# EasyEDA Pro project mini2.epro

# Schematic Schematic1_2
Create Date: 2023-07-10; Page Name: P1; Project Name: 门禁控制器; Schematic Name: Schematic1_2; Update Date: 2023-10-23; Company: WITGINE TECH; Drawed: 囧大大王; Page Size: A4; Version: V1.0
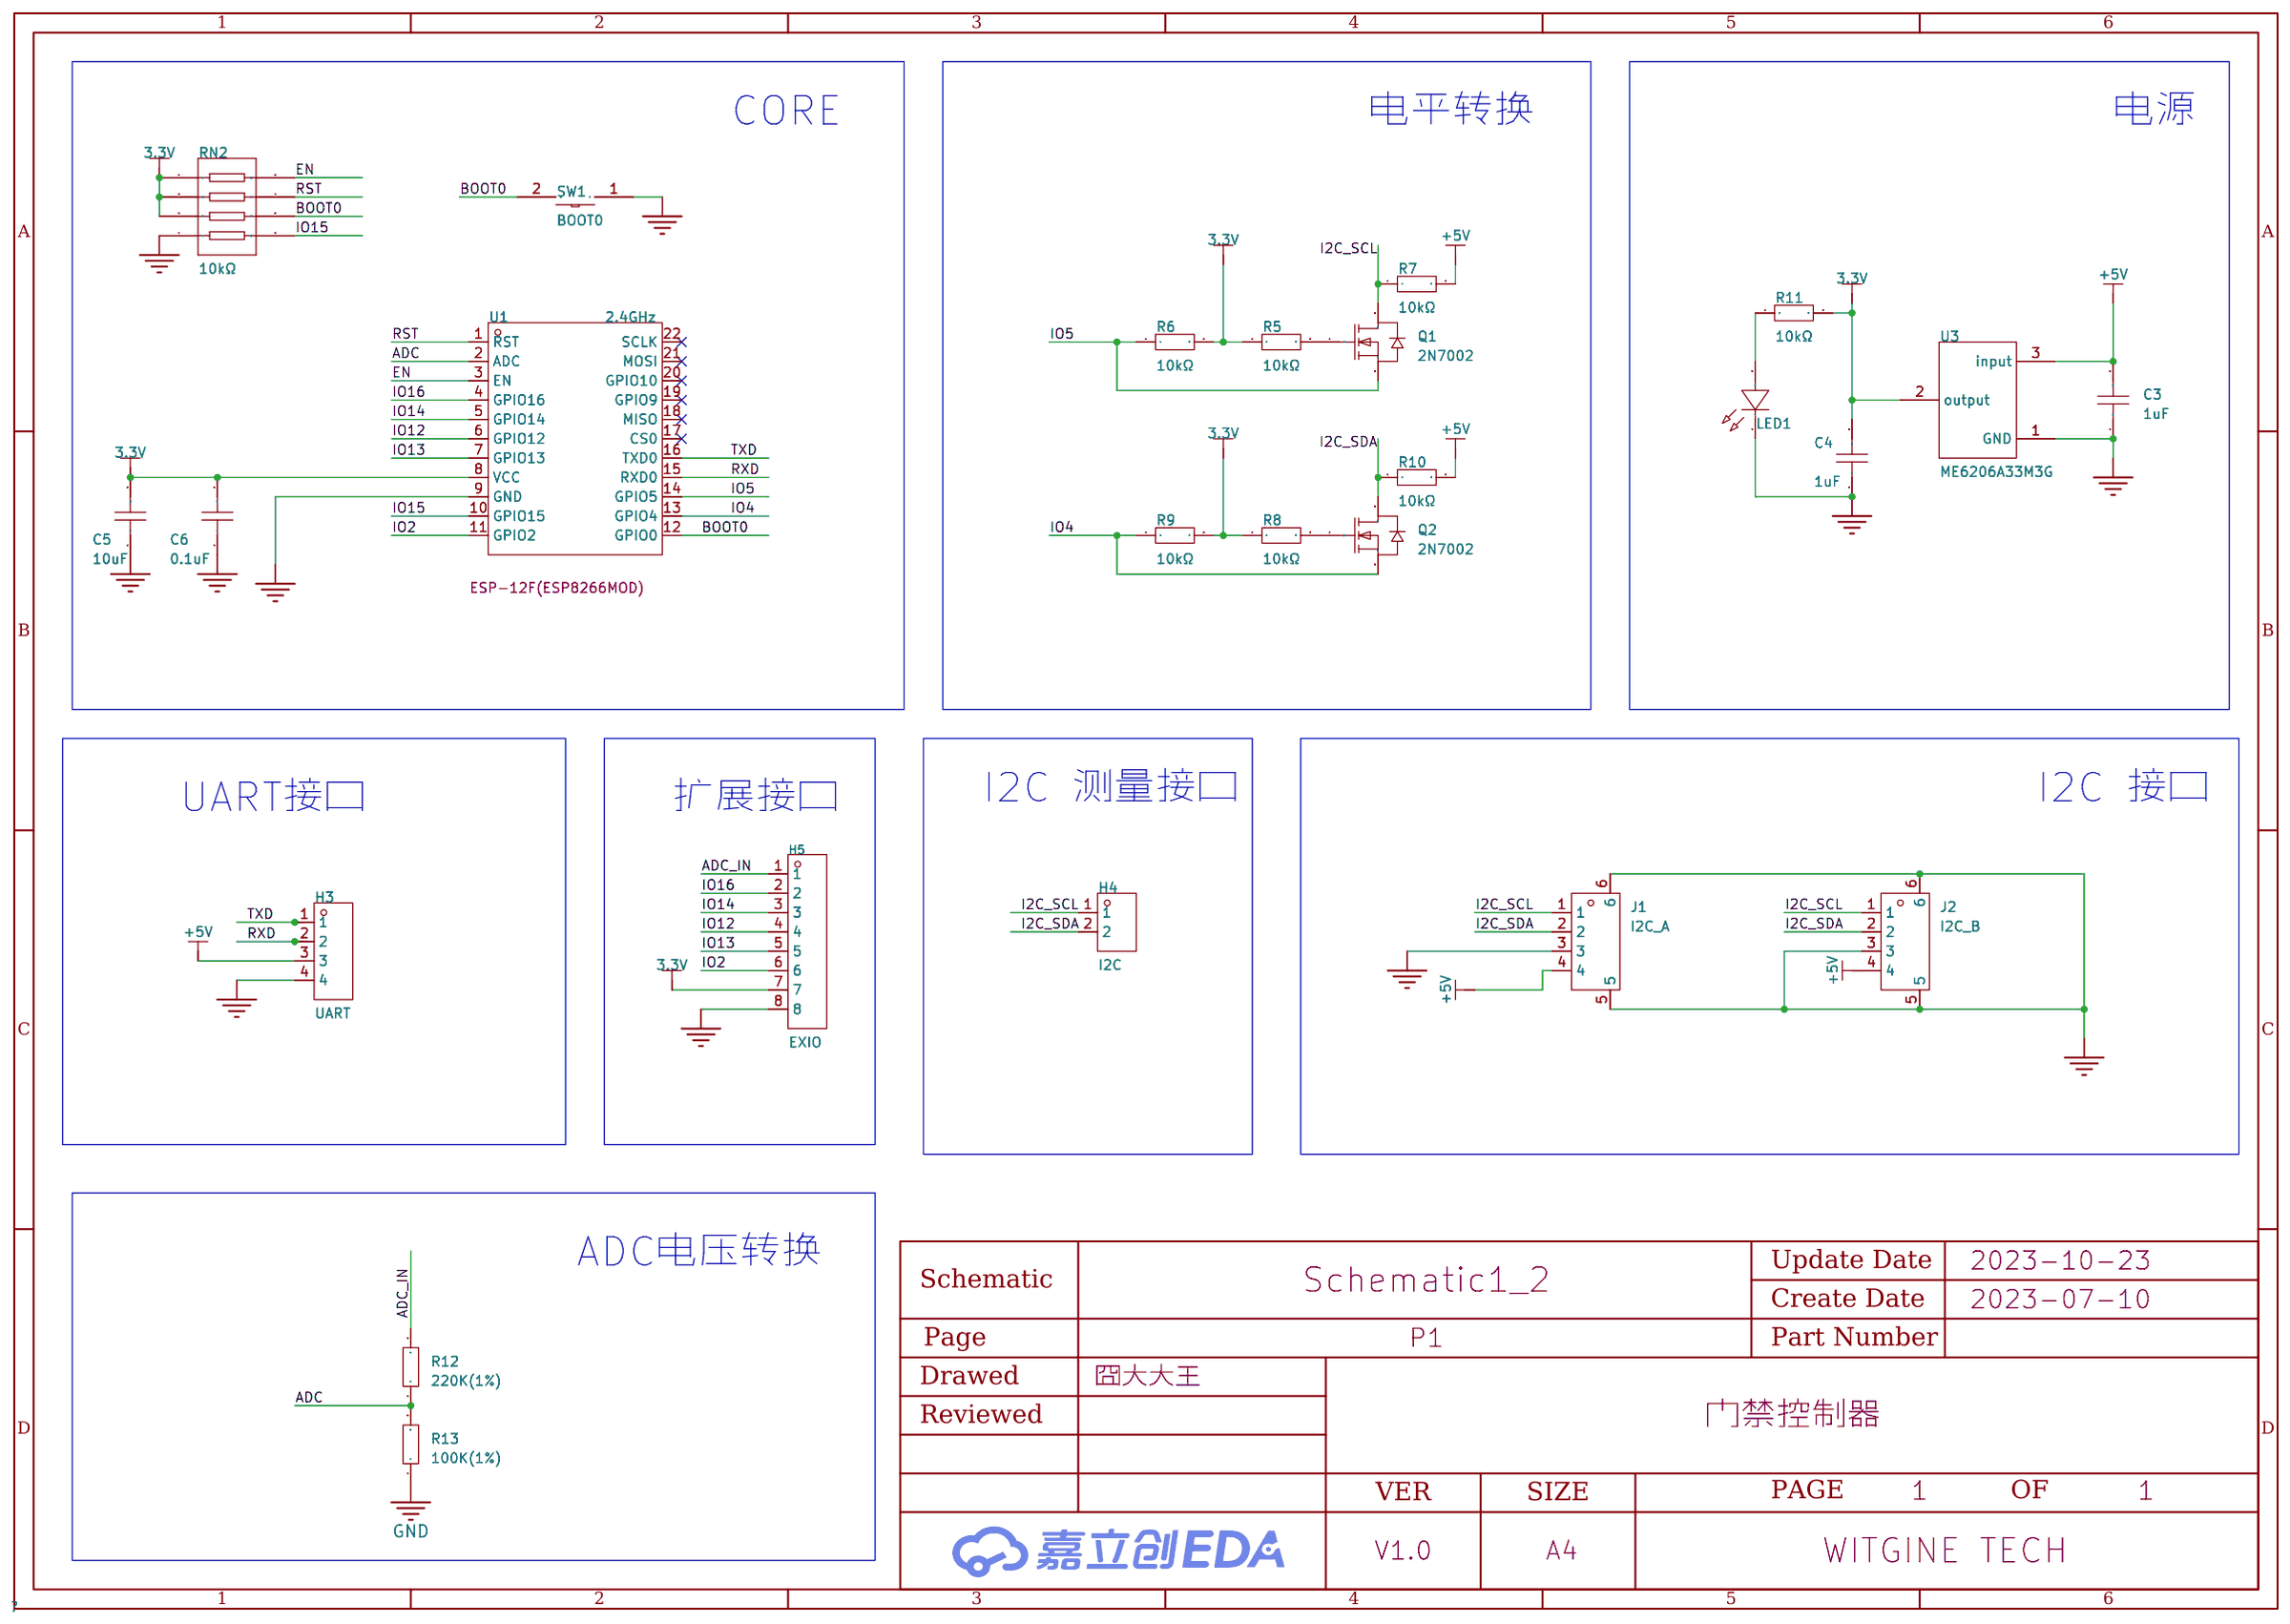
[diagram p0: schematic sheet]

## Parts
C3  1uF  [C0603]
C4  1uF  [C0603]
C5  10uF  [C0603]
C6  0.1uF  [C0603]
H3  UART  [HDR-TH_4P-P2.54-V-M]
H4  I2C  [HDR-TH_2P-P2.54-V-M]
H5  EXIO  [HDR-TH_8P-P2.54-V-M]
J1  I2C_A  [CONN-SMD_1.25-4PWB]
J2  I2C_B  [CONN-SMD_1.25-4PWB]
LED1  XL-1608SURC-06  [LED0603-RD_RED]
Q1  2N7002  [SOT-23-3_L2.9-W1.3-P1.90-LS2.4-BR]
Q2  2N7002  [SOT-23-3_L2.9-W1.3-P1.90-LS2.4-BR]
R5  10kΩ  [R0603]
R6  10kΩ  [R0603]
R7  10kΩ  [R0603]
R8  10kΩ  [R0603]
R9  10kΩ  [R0603]
R10  10kΩ  [R0603]
R11  10kΩ  [R0603]
R12  220K(1%)  [R0603]
R13  100K(1%)  [R0603]
RN2  10kΩ  [RES-ARRAY-SMD_0603-8P-L3.2-W1.6-BL]
SW1  BOOT0  [SW-SMD_L3.9-W3.0-P4.45]
U1  2.4GHz  [WIFIM-SMD_ESP-12F-ESP8266MOD]
U3  ME6206A33M3G  [SOT-23-3_L2.9-W1.6-P1.90-LS2.8-BR]

## Library data of the parts
C3 C5 = CL10A106MA8NRNC: 容值:10uF;精度:±20%;额定电压:25V;材质(温度系数):X5R;; LCSC Part Name: 10uF ±20% 25V; Supplier Part: C96446; Manufacturer: SAMSUNG(三星); Supplier Footprint: 0603; JLCPCB Part Class: Basic Part; Datasheet: https://atta.szlcsc.com/upload/public/pdf/source/20170325/1490427913016.pdf; Supplier: LCSC; Tolerance: ±20%; Voltage Rated: 25V; Temperature Coefficient: X5R
C4 C6 = CL10B104KB8NNNC: 容值:100nF;精度:±10%;额定电压:50V;材质(温度系数):X7R;; LCSC Part Name: 100nF ±10% 50V; Supplier Part: C1591; Manufacturer: SAMSUNG(三星); Supplier Footprint: 0603; JLCPCB Part Class: Extended Part; Datasheet: https://atta.szlcsc.com/upload/public/pdf/source/20160103/1457707680512.pdf; Supplier: LCSC; Tolerance: ±10%; Voltage Rated: 50V; Temperature Coefficient: X7R
H3 = PZ254V-11-04P_C492403: 排数:单排;总PIN位数:4;间距:2.54mm;插针结构:1x4P;行距:-;安装类型:直插;圆针/方针:方针;额定电流:-;额定电压:-;配合针长度:6mm;塑高:2.5mm;端接针长度:3mm;触头材质:黄铜;触头镀层:-;工作温度范围:-40℃~+105℃;颜色:黑色;; LCSC Part Name: 2.54mm 1x4P 直插 方针; Supplier Part: C492403; Manufacturer: XFCN(兴飞); Manufacturer Part: PZ254V-11-04P; Supplier Footprint: 直插,P=2.54mm; JLCPCB Part Class: Extended Part; Datasheet: https://atta.szlcsc.com/upload/public/pdf/source/20200309/C492403_F9F19131791D08044AD4F84F8E751A34.pdf; Supplier: LCSC; Number of Rows: 单排; Number of Pins: 4; Pitch: 2.54mm; Pin Structure: 1x4P; Mounting Type: 直插; Circluar Pins/Square Pins: 方针; Length of Mating Pin: 6mm; Insulation Height: 2.5mm; Length of End Connection Pin: 3mm; Contact Material: 黄铜; Operating Temperature Range: -40℃~+105℃; Color: 黑色
H4 = PZ254V-11-02P: 排数:单排;总PIN位数:2;间距:2.54mm;插针结构:1x2P;行距:-;安装类型:直插;圆针/方针:方针;额定电流:-;额定电压:-;配合针长度:6mm;塑高:2.5mm;端接针长度:3mm;触头材质:黄铜;触头镀层:-;工作温度范围:-40℃~+105℃;颜色:黑色;; LCSC Part Name: 2.54mm 1x2P 直插 方针; Supplier Part: C492401; Manufacturer: XFCN(兴飞); Manufacturer Part: 2.54-1x2P直针; Supplier Footprint: 直插,P=2.54mm; JLCPCB Part Class: Extended Part; Datasheet: https://atta.szlcsc.com/upload/public/pdf/source/20200309/C492401_A812433581A9B211A7FFA413ADDFF0E5.pdf; Supplier: LCSC; Number of Rows: 单排; Number of Pins: 2; Pitch: 2.54mm; Pin Structure: 1x2P; Mounting Type: 直插; Circluar Pins/Square Pins: 方针; Length of Mating Pin: 6mm; Insulation Height: 2.5mm; Length of End Connection Pin: 3mm; Contact Material: 黄铜; Operating Temperature Range: -40℃~+105℃; Color: 黑色
H5 = PZ254V-11-08P: 排数:单排;总PIN位数:8P;间距:2.54mm;插针结构:1x8P;行距:-;安装类型:直插;圆针/方针:方针;额定电流:-;额定电压:-;配合针长度:6mm;塑高:2.5mm;端接针长度:3mm;触头材质:黄铜;触头镀层:-;工作温度范围:-40℃~+105℃;颜色:黑色;; LCSC Part Name: 2.54mm 1x8P 直插 方针; Supplier Part: C492407; Manufacturer: XFCN(兴飞); Supplier Footprint: 插件,P=2.54mm; JLCPCB Part Class: Extended Part; Datasheet: https://atta.szlcsc.com/upload/public/pdf/source/20200309/C492407_83A6FB26A2233368EDB9516968EC6149.pdf; Supplier: LCSC; Number of Rows: 单排; Number of Pins: 8P; Pitch: 2.54mm; Pin Structure: 1x8P; Mounting Type: 直插; Circluar Pins/Square Pins: 方针; Length of Mating Pin: 6mm; Insulation Height: 2.5mm; Length of End Connection Pin: 3mm; Contact Material: 黄铜; Operating Temperature Range: -40℃~+105℃; Color: 黑色
J1 J2 = 1.25-4PWB: 参考系列:-;间距:1.25mm;插针结构:1x4P;排数:1;每排PIN数:4;行距:-;公母:公型插针;安装方式:卧贴;额定电流:-;工作温度范围:-40℃~+85℃;; LCSC Part Name: 1.25mm 1x4P 卧贴; Supplier Part: C2905011; Manufacturer: DEALON(德艺隆); Supplier Footprint: SMD,P=1.25mm; JLCPCB Part Class: Extended Part; Datasheet: https://atta.szlcsc.com/upload/public/pdf/source/20211025/32B11FCE5054D08D2841E43E3DE676AA.pdf; Supplier: LCSC; Pitch: 1.25mm; Pins Structure: 1x4P; Number of Rows: 1; Number of PINs Per Row: 4; Gender: 公型插针; Mounting Style: 卧贴; Operating Temperature Range: -40℃~+85℃
LED1 = XL-1608SURC-06: 发光颜色:红灯;主波长:617nm~621nm;色温:-;功率:55mW;安装方式:正贴;; LCSC Part Name: 红灯 正贴; Supplier Part: C965799; Manufacturer: XINGLIGHT(成兴光); Supplier Footprint: 0603; JLCPCB Part Class: Extended Part; Datasheet: https://atta.szlcsc.com/upload/public/pdf/source/20221102/D860AFDD1CDB02C5A8064103A32707E2.pdf; Supplier: LCSC; Emitted Color: 红灯; Lens Color: 无色透明; Dominant Wavelength: 617nm~621nm; Peak Wavelength: 623nm; Forward Current: 25mA; Power Dissipation: 55mW; Viewing Angle: 120°; Mounting Sytle: 正贴; Operating Temperature: -30℃~+85℃
Q1 Q2 = 2N7002_C8545: 类型:N沟道;漏源电压(Vdss):60V;连续漏极电流(Id):115mA;功率(Pd):200mW;导通电阻(RDS(on)@Vgs,Id):7.5Ω@10V,500mA;阈值电压(Vgs(th)@Id):2.5V@250uA;; LCSC Part Name: N沟道 60V 115mA; Supplier Part: C8545; Manufacturer: CJ(江苏长电/长晶); Supplier Footprint: SOT-23; JLCPCB Part Class: Basic Part; Datasheet: https://atta.szlcsc.com/upload/public/pdf/source/20170302/1488422688078.pdf; Supplier: LCSC; Type: N沟道; Drain Source Voltage (Vdss): 60V; Continuous Drain Current (Id): 115mA; Power Dissipation (Pd): 200mW; Drain Source On Resistance (RDS(on)@Vgs,Id): 7.5Ω@10V,500mA; Gate Threshold Voltage (Vgs(th)@Id): 2.5V@250uA
R5-R10 = RS-03K1002FT: 阻值:10kΩ;精度:±1%;功率:100mW;; LCSC Part Name: 10kΩ ±1% 100mW; Supplier Part: C115324; Manufacturer: FH(风华); Supplier Footprint: 0603; JLCPCB Part Class: Extended Part; Datasheet: https://atta.szlcsc.com/upload/public/pdf/source/20170704/1499151311434.pdf; Supplier: LCSC; Tolerance: ±1%; Power(Watts): 100mW; Temperature Coefficient: ±100ppm/℃; Overload Voltage (Max): 50V; Operating Temperature Range: -55℃~+155℃
R11-R13 = Res_0603: Supplier Footprint: 0603
RN2 = 4D03WGJ0103T5E: 阻值:10kΩ;精度:±5%;单个元件功率:62.5mW;电阻器数:4;; LCSC Part Name: 10kΩ ±5%; Supplier Part: C29718; Manufacturer: UNI-ROYAL(厚声); Supplier Footprint: 0603x4; JLCPCB Part Class: Basic Part; Datasheet: https://atta.szlcsc.com/upload/public/pdf/source/20170615/1497511005633.pdf; Supplier: LCSC; Tolerance: ±5%; Power(Watts): 62.5mW; Number of Resistors: 4; Number of Pins: 8; Temperature Coefficient: ±200ppm/℃
SW1 = TS-1088-AR02016: 触点电流:50mA;额定电压(DC):12V;绝缘电阻:100MΩ;电路结构:单刀单掷;安装方式:立贴;作用力:160gf@±50gf;机械寿命:10万次;带支架:否;; LCSC Part Name: 4*3*2mm 立贴 轻触开关; Supplier Part: C720477; Manufacturer: XUNPU(讯普); Supplier Footprint: SMD; JLCPCB Part Class: Extended Part; Datasheet: https://atta.szlcsc.com/upload/public/pdf/source/20200810/C720475_60D09DD6C54279ADDB2DC25100F1CC11.pdf; Supplier: LCSC; Contact Current: 50mA; Voltage Rating (DC): 12V; Insulation Resistance: 100MΩ; Circuit: 单刀单掷; Mounting Style: 立贴; Actuator Style: 圆形按钮; Actuator/Cap Color: 黑色; Operating Force: 160gf@±50gf; Mechanical Life: 10万次; Operating Temperature: -30℃~+80℃; Pin Style: SMD接片; Switch Length: 4mm; Switch Width: 3mm; Switch Height: 2mm; Strike Gundam: 否; With Lamp: 无
U1 = ESP-12F(ESP8266MOD): 频率:2.4GHz;发射功率:16dBm;核心处理器:ESP8266;天线形式:PCB 板载天线;接收灵敏度:-90dBm;; LCSC Part Name: 完整的802.11b/g/n Wi-Fi的SoC模块; Supplier Part: C82891; Manufacturer: Ai-Thinker(安信可); Supplier Footprint: SMD,16x24mm; JLCPCB Part Class: 扩展库; Datasheet: https://atta.szlcsc.com/upload/public/pdf/source/20210219/C82891_ABD84A460F4F056A2757267CCCA4B508.pdf; Supplier: LCSC; Output Power: 16dBm; Core Processor: ESP8266; Support Interface: GPIO；UART；I2C；PWM；SPI；ADC; Antenna Type: PCB 板载天线; Wireless Standard: 802.11b/g/n; Operating Voltage: 3.3V; Receive  Current: 120mA; Send  Current: 170mA; Sensitivity: -90dBm; Operating Temperature: -40℃~+85℃
U3 = ME6206A33M3G: 输出类型:固定;输出极性:正;最大输入电压:6V;输出电压:3.3V;输出电流:300mA;电源纹波抑制比(PSRR):50dB@(1kHz);; Supplier Part: C35259; Manufacturer: MICRONE(南京微盟); Supplier Footprint: SOT-23-3L; JLCPCB Part Class: Extended Part; Datasheet: https://atta.szlcsc.com/upload/public/pdf/source/20171014/C35259_15079757490131038524.pdf; Supplier: LCSC; Output Type: 固定; Output Polarity: 正; Number of Outputs: 1; Maximum Input Voltage: 6V; Output Voltage: 3.3V; Dropout Voltage: 380mV@(200mA); Output Current: 300mA; Power Supply Rejection Ratio (PSRR): 50dB@(1kHz)

## Nets
3.3V: C4.2 C5.2 C6.2 H5.7 R5.1 R6.2 R8.1 R9.2 R11.2 RN2.1 RN2.2 RN2.3 U1.8(VCC) U3.2(output)
+5V: C3.2 H3.3 J1.4 J2.4 R7.2 R10.2 U3.3(input)
GND: C3.1 C4.1 C5.1 C6.1 H3.4 H5.8 J1.3 J1.5 J1.6 J2.3 J2.5 J2.6 LED1.1(K) R13.1 RN2.4 SW1.1 U1.9(GND) U3.1(GND)
ADC: R12.1 R13.2 U1.2(ADC)
ADC_IN: H5.1 R12.2
BOOT0: RN2.6 SW1.2 U1.12(GPIO0)
EN: RN2.8 U1.3(EN)
I2C_SCL: H4.1 J1.1 J2.1 Q1.3(D) R7.1
I2C_SDA: H4.2 J1.2 J2.2 Q2.3(D) R10.1
IO2: H5.6 U1.11(GPIO2)
IO4: Q2.2(S) R9.1 U1.13(GPIO4)
IO5: Q1.2(S) R6.1 U1.14(GPIO5)
IO12: H5.4 U1.6(GPIO12)
IO13: H5.5 U1.7(GPIO13)
IO14: H5.3 U1.5(GPIO14)
IO15: RN2.5 U1.10(GPIO15)
IO16: H5.2 U1.4(GPIO16)
RST: RN2.7 U1.1(RST)
RXD: H3.2 U1.15(RXD0)
TXD: H3.1 U1.16(TXD0)
$1N20405: Q1.1(G) R5.2
$1N20410: Q2.1(G) R8.2
Net-(LED1-2): LED1.2(A) R11.1

Not connected (* = marked no-connect by the designer): U1 17(CS0)* 18(MISO)* 19(GPIO9)* 20(GPIO10)* 21(MOSI)* 22(SCLK)*

## Notes on the sheet
- CORE
- 电平转换
- 电源
- UART接口
- 扩展接口
- I2C 测量接口
- I2C 接口
- ADC电压转换

# Board PCB1_2
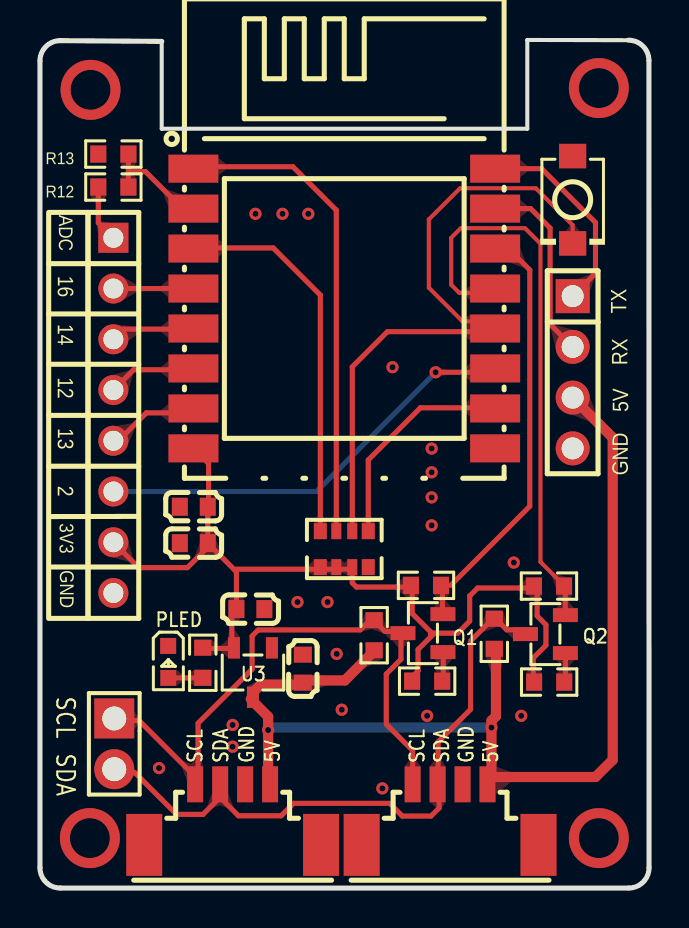
[diagram p1: board, top side]
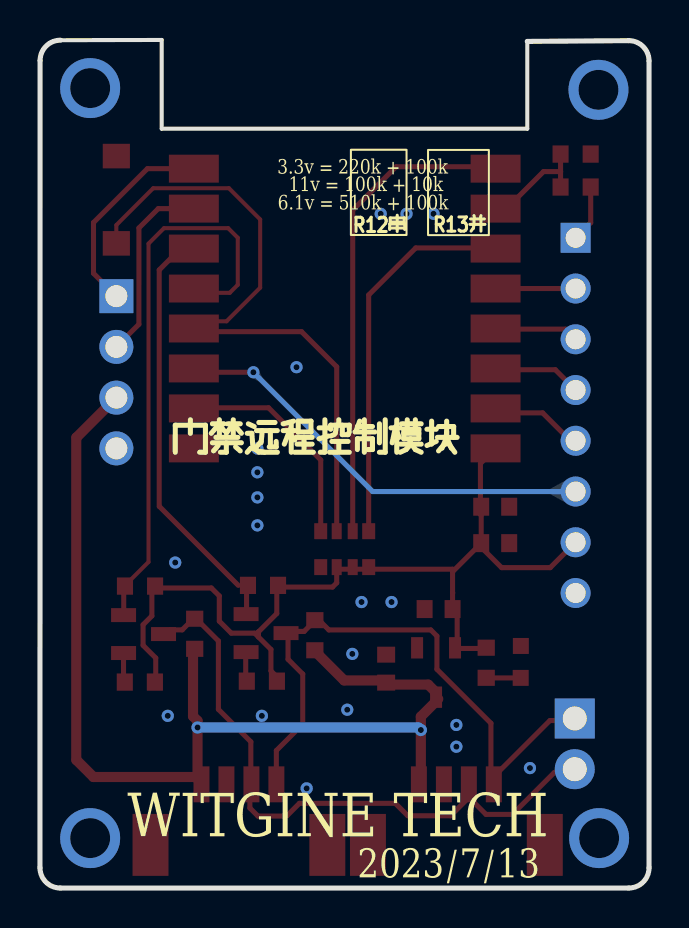
[diagram p2: board, bottom side, seen from below]

Outline 30.48 x 42.45 mm; copper layers: Top Layer, Bottom Layer. Coordinates in mm from the lower left corner of the outline.
Outline path: 0,41.4 0,1.02 arc(0.3,0.3) 1.02,0 29.47,0 arc(30.19,0.3) 30.48,1.02 30.48,41.42 arc(30.18,42.14) 29.46,42.44 24.39,42.45 24.39,38.01 6.09,38.01 6.09,42.38 1.02,42.42 arc(0.3,42.12) 0,41.4
Stack: Top Layer 0.035mm / Dielectric1 1.51mm FR4 er 4.5 / Bottom Layer 0.035mm

## Design rules (mm)
template: JLCPCB Capability(Two Layers Board)
spacing copperThickness1oz (default): track to track 0.102, other pairs 0.152 to 0.3
spacing copperThickness2oz: track to track 0.203, other pairs 0.152 to 0.3
track width copperThickness1oz (default): min 0.127, default 0.254, max 2.54
track width copperThickness2oz: min 0.203, default 0.254, max 2.54
differential pair differentialPair (default): width min 0.127, default 0.254, max 2.54; gap min 0.152, default 0.152
via viaSize (default): diameter min 0.5, default 0.61, max 10; hole min 0.3, default 0.305, max 6.3

## Placement (name value [footprint] x y rotation side)
C3  1uF  [C0603]  13.16 10.98 270 top
C4  1uF  [C0603]  10.53 13.96 180 top
C5  10uF  [c0603]  7.7 19.09 0 top
C6  0.1uF  [C0603]  7.7 17.26 0 top
H3  UART  [HDR-TH_4P-P2.54-V-M]  26.66 25.82 270 top
H4  I2C  [HDR-TH_2P-P2.54-V-M]  3.72 7.22 270 top
H5  EXIO  [HDR-TH_8P-P2.54-V-M]  3.67 23.66 270 top
J1  I2C_A  [CONN-SMD_1.25-4PWB]  9.64 3.68 0 top
J2  I2C_B  [conn-smd_1.25-4pwb]  20.53 3.68 0 top
PLED  XL-1608SURC-06  [LED0603-RD_RED]  6.42 11.32 270 top
Q1  2N7002  [SOT-23-3_L2.9-W1.3-P1.90-LS2.4-BR]  19.17 12.76 0 top
Q2  2N7002  [SOT-23-3_L2.9-W1.3-P1.90-LS2.4-BR]  25.3 12.71 0 top
R5  10kΩ  [R0603]  19.38 10.36 0 top
R6  10kΩ  [R0603]  19.32 15.15 180 top
R7  10kΩ  [R0603]  16.73 12.65 270 top
R8  10kΩ  [R0603]  25.49 10.31 0 top
R9  10kΩ  [R0603]  25.48 15.11 180 top
R10  10kΩ  [R0603]  22.74 12.73 270 top
R11  10kΩ  [R0603]  8.15 11.28 90 top
R12  220K(1%)  [R0603]  3.67 35.09 180 top
R13  100K(1%)  [R0603]  3.67 36.74 0 top
RN2  10kΩ  [RES-ARRAY-SMD_0603-8P-L3.2-W1.6-BL]  15.23 16.96 0 top
SW1  BOOT0  [SW-SMD_L3.9-W3.0-P4.45]  26.66 34.45 270 top
U1  2.4GHz  [WIFIM-SMD_ESP-12F-ESP8266MOD]  15.23 28.36 270 top
U3  ME6206A33M3G  [SOT-23-3_L2.9-W1.6-P1.90-LS2.8-BR]  10.66 10.79 90 top

## Footprints (pads in the part's own frame, mm; a bottom-side part is the same pattern mirrored in y, then rotated)
c0603
  rect 0.8x0.9 smd: 1(-0.7,0) 2(0.7,0)
C0603
  rect 0.8x0.9 smd: 1(-0.7,0) 2(0.7,0)
conn-smd_1.25-4pwb
  rect 0.8x1.8 smd: 1(-1.875,1.516) 2(-0.625,1.516) 3(0.625,1.516) 4(1.875,1.516)
  rect 1.8x3.1 smd: 5(-4.425,-1.516) 6(4.425,-1.516)
CONN-SMD_1.25-4PWB
  rect 0.8x1.8 smd: 1(-1.875,1.516) 2(-0.625,1.516) 3(0.625,1.516) 4(1.875,1.516)
  rect 1.8x3.1 smd: 5(-4.425,-1.516) 6(4.425,-1.516)
HDR-TH_2P-P2.54-V-M
  rect 2x2 hole 1.2: 1(-1.27,0)
  round 2 hole 1.2: 2(1.27,0)
HDR-TH_4P-P2.54-V-M
  rect 1.7x1.7 hole 1.1: 1(-3.81,0)
  round 1.7 hole 1.1: 2(-1.27,0) 3(1.27,0) 4(3.81,0)
HDR-TH_8P-P2.54-V-M
  rect 1.5x1.5 hole 1: 1(-8.89,0)
  round 1.5 hole 1: 2(-6.35,0) 3(-3.81,0) 4(-1.27,0) 5(1.27,0) 6(3.81,0) 7(6.35,0) 8(8.89,0)
LED0603-RD_RED
  rect 0.8x0.8 smd: 1(-0.799,-0.004) 2(0.799,0.004)
R0603
  rect 0.806x0.864 smd: 1(-0.753,0) 2(0.753,0)
RES-ARRAY-SMD_0603-8P-L3.2-W1.6-BL
  rect 0.65x0.8 smd: 1(-1.2,-0.9) 4(1.2,-0.9) 5(1.2,0.9) 8(-1.2,0.9)
  rect 0.5x0.8 smd: 2(-0.4,-0.9) 3(0.4,-0.9) 6(0.4,0.9) 7(-0.4,0.9)
SOT-23-3_L2.9-W1.3-P1.90-LS2.4-BR
  rect 1.25x0.7 smd: 1(1,-0.95) 2(1,0.95) 3(-1,0)
SOT-23-3_L2.9-W1.6-P1.90-LS2.8-BR
  rect 1.07x0.6 smd: 1(1.235,-0.95) 2(1.235,0.95) 3(-1.235,0)
SW-SMD_L3.9-W3.0-P4.45
  rect 1.23x1.36 smd: 1(-2.185,0) 2(2.185,0)
WIFIM-SMD_ESP-12F-ESP8266MOD
  rect 1.4x2.5 smd: 1(-7.651,-7.551) 2(-5.651,-7.551) 3(-3.651,-7.551) 4(-1.651,-7.551) 5(0.349,-7.551) 6(2.349,-7.551) 7(4.349,-7.551) 8(6.349,-7.551) 9(6.349,7.548) 10(4.349,7.55) 11(2.349,7.551) 12(0.349,7.551) 13(-1.651,7.55) 14(-3.651,7.551) 15(-5.651,7.551) 16(-7.651,7.551)

## Nets
As in the schematic, except:
GND: C3.1 C4.1 C5.1 C6.1 H3.4 H5.8 J1.3 J1.5 J1.6 J2.3 J2.5 J2.6 PLED.1 R13.1 RN2.4 SW1.1 U1.9 U3.1
$1N18118: PLED.2 R11.1

## Via types
v1: diameter 3, hole 2, Top Layer to Bottom Layer, 4 vias
v2: diameter 0.61, hole 0.305, Top Layer to Bottom Layer, 22 vias

## Routing (per net, layer and track width the routed paths; a pad name or vN(x,y) marks a point on that pad's centre or on a via; arc(x,y) is an arc through that point)
3.3V: length 45.3
  Top Layer w0.254: 8.43,11.99 9.6,11.99 ; 9.6,11.99 9.6,11.85 ; 9.6,11.99 9.61,11.99 9.67,12.06 ; 9.6,11.99 9.6,13.67 9.78,13.84 ; 18.63,15.02 18.63,13.74 19.55,12.82 ; 9.83,14.78 9.83,14.78 ; 9.83,14.78 C4.2 ; 9.83,14.78 9.83,15.83 ; 19.55,12.82 19.61,12.76 ; 19.55,12.82 19.55,12.57 ; 9.83,15.83 9.83,15.96 15.47,15.96 ; 9.83,15.83 C6.2 ; 19.55,12.57 18.92,11.94 18.92,10.87 18.44,10.38 ; 19.55,12.57 19.74,12.76 20.91,12.76 21.51,13.36 21.51,14.62 21.9,15.02 24.62,15.02 24.64,14.99 ; C6.2 8.4,17.06 7.38,16.04 4.94,16.04 H5.7 ; C6.2 8.4,18.67 8.44,18.7 8.44,21.25 U1.8 ; RN2.3 15.63,15.28 15.84,15.06 18.63,15.06 ; 24.69,10.19 24.69,11.52 25.32,12.15 25.32,13.18 24.88,13.62 24.88,14.8
+5V: length 54.5
  Top Layer w0.508: 10.64,9.36 10.65,9.37 ; 10.65,9.37 10.55,9.46 ; 10.65,9.37 10.65,9.78 11.05,10.18 13.2,10.18 ; 16.67,11.81 15.26,10.39 13.39,10.39 ; 10.64,9.36 11.42,8.58 v2(11.42,7.91) 11.42,5.63 11.44,5.62 ; 22.6,5.56 22.53,5.56 22.52,5.55 ; 22.6,5.56 27.81,5.56 28.66,6.41 ; 22.6,5.56 22.6,5.46 22.47,5.34 ; 22.6,5.56 v2(22.6,8.04) 22.6,8.37 22.82,8.6 22.82,11.71 ; 13.2,10.25 13.2,10.18 ; 13.2,10.18 13.25,10.18 ; 28.66,22.55 H3.3 ; 28.67,6.41 28.67,22.55
  Bottom Layer w0.508: v2(22.6,8.04) 11.55,8.04 v2(11.42,7.91)
GND:
  vias: v1(2.5,2.5) v1(27.97,2.5) v2(5.96,6) v2(9.64,8.16) v2(9.64,7.07) v2(10.79,33.75) v2(12.14,33.75) v2(12.89,14.32) v2(13.43,33.75) v2(14.39,14.32) v2(14.85,11.72) v2(15.1,8.93) v2(17.14,4.99) v2(17.64,26.07) v2(19.38,8.62) v2(19.6,22) v2(19.6,20.81) v2(19.6,19.55) v2(19.6,18.15) v2(23.71,16.29) v2(24.09,8.62)
(no net):
  vias: v1(2.53,39.95) v1(27.97,40.04)
ADC: length 5.3
  Top Layer w0.254: 7.18,33.96 5.28,35.86 4.43,35.86 ; 4.43,34.93 4.57,34.93 4.43,35.07 4.43,35.86 ; 4.43,35.86 4.43,36.44
ADC_IN: length 2.7
  Top Layer w0.254: H5.1 2.92,33.3 2.92,34.93
BOOT0: length 32.4
  Top Layer w0.203: SW1.2 26.66,33.18 24.82,35.03 21.02,35.03 19.46,33.47 19.46,30.05 21.14,28.37 22.06,28.37
  Top Layer w0.254: RN2.6 15.63,26.09 17.39,27.85 22.62,27.85 U1.12
EN: length 19.2
  Top Layer w0.254: RN2.8 14.03,29.68 11.68,32.04 7.71,32.04 U1.3
I2C_SCL: length 29.4
  Top Layer w0.254: 4.04,8.38 4.96,8.38 7.74,5.61 ; 7.83,5.4 7.91,5.48 7.91,8.25 10.62,10.95 10.62,12.61 10.92,12.92 16.02,12.92 16.54,13.43 ; 18.07,12.63 18.07,11.45 17.33,10.71 17.33,8.2 18.65,6.88 18.65,5.14 ; 16.78,13.33 17.26,12.84 18.15,12.84
I2C_SDA: length 30.6
  Top Layer w0.254: 3.66,5.78 4.75,5.78 6.84,3.69 8.16,3.69 9.02,4.55 ; 19.98,4.95 19.98,4.01 19.58,3.6 18.13,3.6 17.5,4.24 12.69,4.24 12.07,3.62 9.93,3.62 9.02,4.53 9.02,4.55 ; 9.02,4.55 9.02,4.66 ; 9.02,4.66 8.93,4.75 ; 9.02,4.66 9.02,4.76 ; 19.93,5.23 19.93,7.32 21.55,8.95 21.55,12.37 22.76,13.58 ; 22.96,13.33 23.36,12.92 23.95,12.92
IO2: length 21.7
  Top Layer w0.254: U1.11 22.59,25.82 v2(19.8,25.82)
  Bottom Layer w0.254: v2(19.8,25.82) 13.83,19.85 H5.6
IO4: length 27.8
  Top Layer w0.203: 22.1,29.79 20.99,29.79 20.58,30.2 20.58,32.55 21.06,33.03 24.28,33.03 25.05,32.25 25.05,16.32 26.23,15.14 26.23,15.11
  Top Layer w0.254: 26.32,14.94 26.29,14.9 26.29,13.79
IO5: length 20.8
  Top Layer w0.254: U1.14 23,31.79 23.67,31.79 24.52,30.94 24.52,19.1 ; 20.14,13.81 20.14,14.87 20.24,14.97 ; 20.56,15.15 24.51,19.1
IO12: length 4.5
  Top Layer w0.254: U1.6 7.62,25.94 4.69,25.94 H5.4
IO13: length 4.7
  Top Layer w0.254: U1.7 7.46,23.78 5.33,23.78 3.93,22.39 H5.5
IO14: length 4.2
  Top Layer w0.254: H5.3 4.18,27.98 7.65,27.98 U1.5
IO15: length 11
  Top Layer w0.254: U1.10 22.75,24.04 19.04,24.04 16.43,21.43 16.43,17.86
IO16: length 4
  Top Layer w0.254: 7.68,30.01 H5.2
RST: length 24.2
  Top Layer w0.254: U1.1 7.78,36.1 12.66,36.1 14.83,33.93 14.83,17.86
RXD: length 9.6
  Top Layer w0.254: U1.15 24.56,34.01 25.53,33.04 25.53,28.22 26.66,27.09 H3.2
TXD: length 10.3
  Top Layer w0.254: U1.16 25.11,36.01 27.8,33.31 27.8,30.77 H3.1
$1N18118: length 1.7
  Top Layer w0.254: PLED.2 8.14,10.52 R11.1
$1N20405: length 1.2
  Top Layer w0.254: 20.19,10.33 20.19,11.52
$1N20410: length 1.3
  Top Layer w0.254: 26.28,11.68 26.3,11.66 26.3,10.42

## Copper pours and planes (outline as drawn; the poured copper is in the pictures)
GND on Top Layer: -1.53,38.07 31.36,38.07 31.36,-3.97 -1.53,-3.97
GND on Bottom Layer: -1.41,38.03 32.38,38.03 32.38,-0.96 -1.41,-0.96

Small or netless copper shapes (teardrops, artwork), in the pictures only: 85 on Top Layer, 2 on Bottom Layer

## Text on the board
Bottom Silkscreen Layer: R13并 | R12串 | 11v = 100k + 10k | 6.1v = 510k + 100k | 3.3v = 220k + 100k | 门禁远程控制模块 | 2023/7/13 | WITGINE TECH
Top Silkscreen Layer: SCL | SDA | GND | 5V | 3V3 | ADC | 14 | 12 | 2 | 13 | 16 | TX | RX
